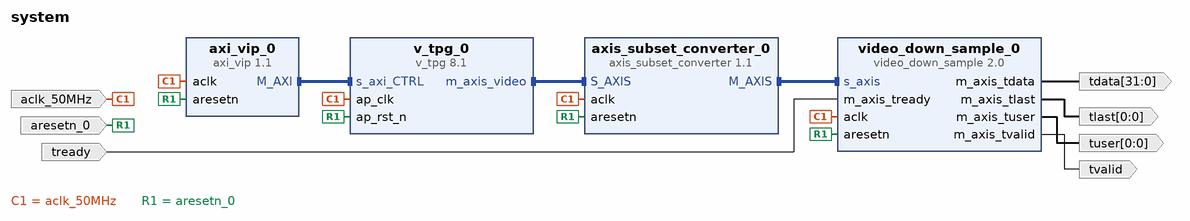
[diagram p0: block diagram of the top level]
# Vivado block design system, xczu2cg-sfvc784-1-e, Vivado 2020.2
create_bd_design system

create_bd_port -dir I -type clk aclk_50MHz
set_property -dict {CONFIG.FREQ_HZ 50000000} [get_bd_ports aclk_50MHz]
create_bd_port -dir I -type rst aresetn_0
create_bd_port -dir O -from 31 -to 0 tdata
create_bd_port -dir O -from 0 -to 0 tlast
create_bd_port -dir I tready
create_bd_port -dir O -from 0 -to 0 tuser
create_bd_port -dir O tvalid

create_bd_cell -type ip -vlnv xilinx.com:ip:axi_vip:1.1 axi_vip_0
set_property -dict [list \
  CONFIG.ADDR_WIDTH 12 \
  CONFIG.DATA_WIDTH 32 \
  CONFIG.HAS_BRESP 1 \
  CONFIG.HAS_PROT 1 \
  CONFIG.HAS_RRESP 1 \
  CONFIG.HAS_WSTRB 1 \
  CONFIG.INTERFACE_MODE MASTER \
  CONFIG.PROTOCOL AXI4LITE \
  CONFIG.READ_WRITE_MODE READ_WRITE \
] [get_bd_cells axi_vip_0]
create_bd_cell -type ip -vlnv xilinx.com:ip:axis_subset_converter:1.1 axis_subset_converter_0
set_property -dict [list \
  CONFIG.M_TDATA_NUM_BYTES 4 \
  CONFIG.S_TDATA_NUM_BYTES 6 \
  CONFIG.TDATA_REMAP {tdata[7:0],tdata[7:0],tdata[7:0],tdata[7:0]} \
] [get_bd_cells axis_subset_converter_0]
create_bd_cell -type ip -vlnv xilinx.com:ip:v_tpg:8.1 v_tpg_0
set_property -dict {CONFIG.HAS_AXI4_YUV422_YUV420 1 CONFIG.MAX_DATA_WIDTH 8 CONFIG.SAMPLES_PER_CLOCK 2} [get_bd_cells v_tpg_0]
create_bd_cell -type ip -vlnv xilinx.com:user:video_down_sample:2.0 video_down_sample_0
set_property -dict [list \
  CONFIG.COLUMN_DOWN false \
  CONFIG.LINE_DOWN false \
  CONFIG.MAXIMUM_DATA_WIDTH 8 \
  CONFIG.SAMPLES_PER_CLOCK 2 \
  CONFIG.VIDEO_FORMAT 2 \
] [get_bd_cells video_down_sample_0]

# ---- connections ----

connect_bd_intf_net [get_bd_intf_pins axis_subset_converter_0/M_AXIS] [get_bd_intf_pins video_down_sample_0/s_axis]
connect_bd_intf_net [get_bd_intf_pins axis_subset_converter_0/S_AXIS] [get_bd_intf_pins v_tpg_0/m_axis_video]
connect_bd_intf_net [get_bd_intf_pins axi_vip_0/M_AXI] [get_bd_intf_pins v_tpg_0/s_axi_CTRL]
connect_bd_net -net aclk_0_1 [get_bd_ports aclk_50MHz] \
  [get_bd_pins axi_vip_0/aclk] [get_bd_pins axis_subset_converter_0/aclk] [get_bd_pins v_tpg_0/ap_clk] \
  [get_bd_pins video_down_sample_0/aclk]
connect_bd_net -net aresetn_0_1 [get_bd_ports aresetn_0] \
  [get_bd_pins axi_vip_0/aresetn] [get_bd_pins axis_subset_converter_0/aresetn] [get_bd_pins v_tpg_0/ap_rst_n] \
  [get_bd_pins video_down_sample_0/aresetn]
connect_bd_net [get_bd_ports tready] [get_bd_pins video_down_sample_0/m_axis_tready]
connect_bd_net [get_bd_pins video_down_sample_0/m_axis_tdata] [get_bd_ports tdata]
connect_bd_net [get_bd_pins video_down_sample_0/m_axis_tlast] [get_bd_ports tlast]
connect_bd_net [get_bd_pins video_down_sample_0/m_axis_tuser] [get_bd_ports tuser]
connect_bd_net [get_bd_pins video_down_sample_0/m_axis_tvalid] [get_bd_ports tvalid]

# ---- address map ----
assign_bd_address -offset 0x000 -range 4K -target_address_space [get_bd_addr_spaces axi_vip_0/Master_AXI] [get_bd_addr_segs v_tpg_0/s_axi_CTRL/Reg]

validate_bd_design
save_bd_design
